# EAGLE design RN-131G Breakout-v13 (EAGLE 6.2)
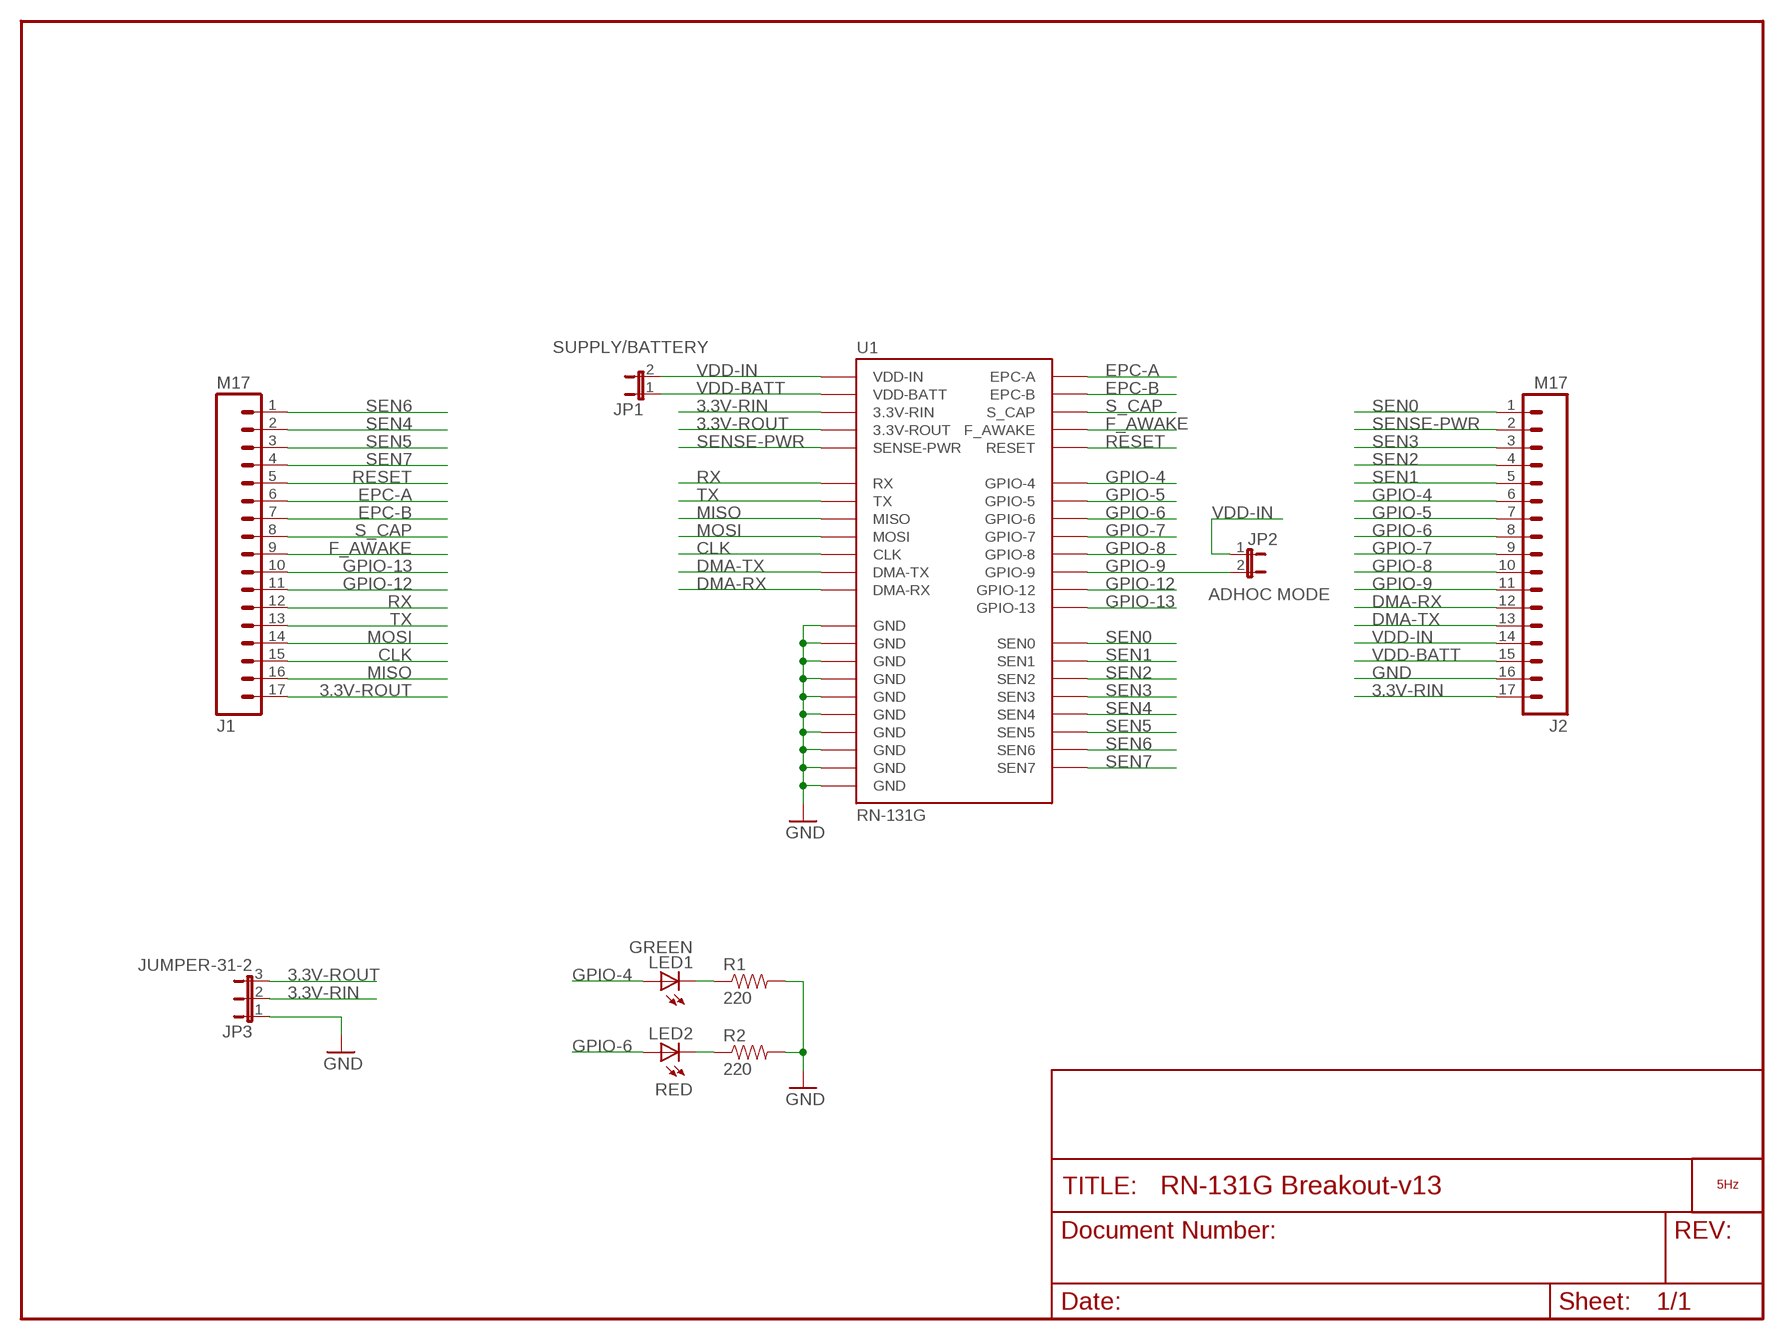
[diagram p0: schematic, sheet 1]

## Parts
J1  M17  [1X17]
J2  M17  [1X17]
JP1  JUMPER-2SMD-NO  [SJ_2S-NO]
JP2  JUMPER-2SMD-NO  [SJ_2S-NO]
JP3  JUMPER-31-2  [SJ_3_PASTE1&2]
LED1  GREEN  LED0603  [LED-0603]
LED2  RED  LED0603  [LED-0603]
LOGO1  LOGO_5HZ_H_10MM  [5HZ_LOGO_H_10MM]
R1  220  RESISTOR0402-RES  [0402-RES]
R2  220  RESISTOR0402-RES  [0402-RES]
U1  RN-131G  [RN-131G]

## Nets
3.3V-RIN: J2.17 JP3.2 U1.P$18(3.3V-RIN)
3.3V-ROUT: J1.17 JP3.3 U1.P$17(3.3V-ROUT)
CLK: J1.15 U1.P$15(CLK)
DMA-RX: J2.12 U1.P$23(DMA-RX)
DMA-TX: J2.13 U1.P$22(DMA-TX)
EPC-A: J1.6 U1.P$6(EPC-A)
EPC-B: J1.7 U1.P$7(EPC-B)
F_AWAKE: J1.9 U1.P$9(F_AWAKE)
GND: J2.16 JP3.1 R1.2 R2.2 U1.P$19(GND) U1.P$36(GND) U1.P$37(GND) U1.P$38(GND) U1.P$39(GND) U1.P$40(GND) U1.P$41(GND) U1.P$42(GND) U1.P$43(GND) U1.P$44(GND)
GPIO-4: J2.6 LED1.A U1.P$29(GPIO-4)
GPIO-5: J2.7 U1.P$28(GPIO-5)
GPIO-6: J2.8 LED2.A U1.P$27(GPIO-6)
GPIO-7: J2.9 U1.P$26(GPIO-7)
GPIO-8: J2.10 U1.P$25(GPIO-8)
GPIO-9: J2.11 JP2.2 U1.P$24(GPIO-9)
GPIO-12: J1.11 U1.P$11(GPIO-12)
GPIO-13: J1.10 U1.P$10(GPIO-13)
MISO: J1.16 U1.P$16(MISO)
MOSI: J1.14 U1.P$14(MOSI)
N$1: LED2.C R2.1
N$2: LED1.C R1.1
RESET: J1.5 U1.P$5(RESET)
RX: J1.12 U1.P$12(RX)
S_CAP: J1.8 U1.P$8(S_CAP)
SEN0: J2.1 U1.P$34(SEN0)
SEN1: J2.5 U1.P$30(SEN1)
SEN2: J2.4 U1.P$31(SEN2)
SEN3: J2.3 U1.P$32(SEN3)
SEN4: J1.2 U1.P$2(SEN4)
SEN5: J1.3 U1.P$3(SEN5)
SEN6: J1.1 U1.P$1(SEN6)
SEN7: J1.4 U1.P$4(SEN7)
SENSE-PWR: J2.2 U1.P$33(SENSE-PWR)
TX: J1.13 U1.P$13(TX)
VDD-BATT: J2.15 JP1.1 U1.P$20(VDD-BATT)
VDD-IN: J2.14 JP1.2 JP2.1 U1.P$21(VDD-IN)

## Notes on the sheet
- SUPPLY/BATTERY
- ADHOC MODE

## Library data of the parts
J1 J2 = SparkFun:M17
JP1 JP2 = SparkFun:JUMPER-2: Jumper Basic 0.1" spaced jumper. Use with breakaway headers.
JP3 = SparkFun:JUMPER-3
LED1 LED2 = SparkFun:LED: LEDs Standard schematic elements and footprints for 5mm, 3mm, 1206, and 0603 sized LEDs. 5mm - Spark Fun Electronics SKU : COM-00529 (and others)
LOGO1 = 5hz-electronica:LOGO_5HZ: Logotipo 5Hz "según Pedro"
R1 R2 = SparkFun:RESISTOR: Resistor Basic schematic elements and footprints for 0603, 1206, and PTH 1/10th watt (small) resistors.
U1 = SparkFun:RN-131G: Roving Netowrks WiFLy GSX Module

## Board
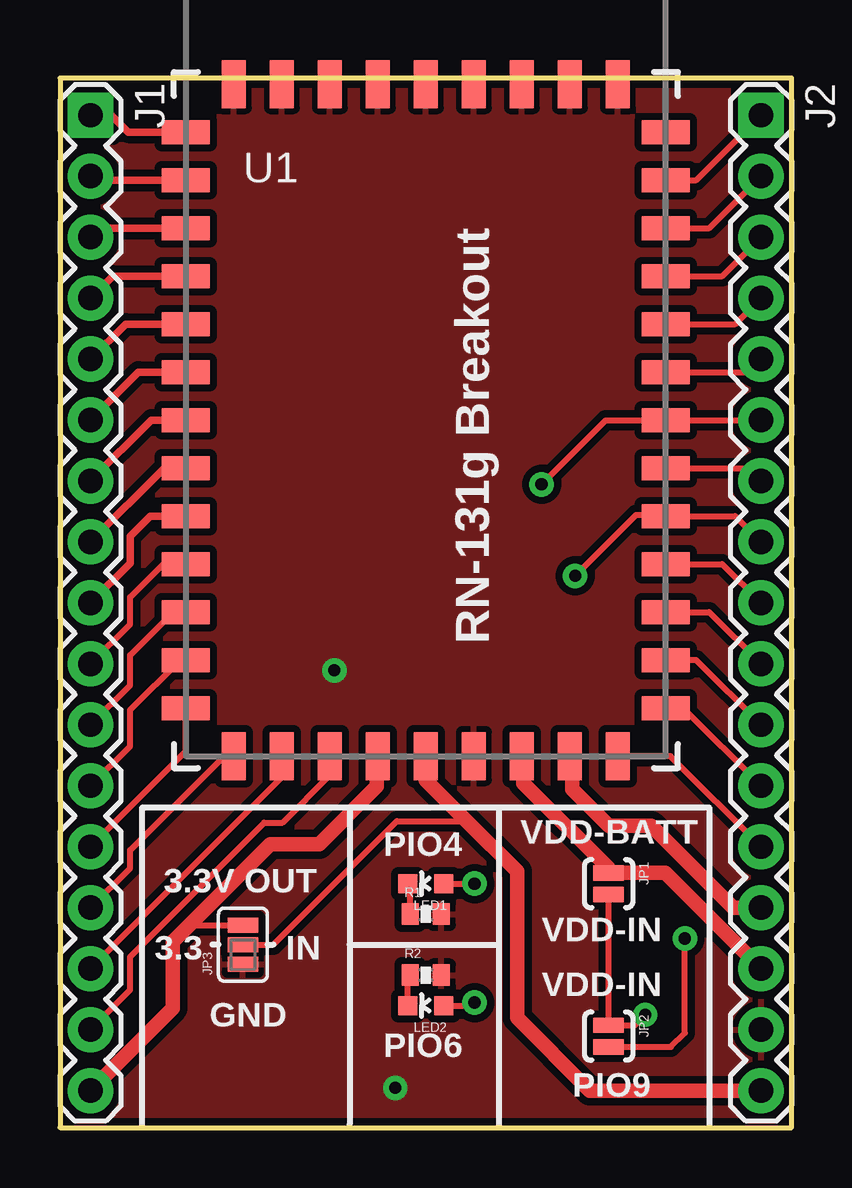
[diagram p1: board, top side]
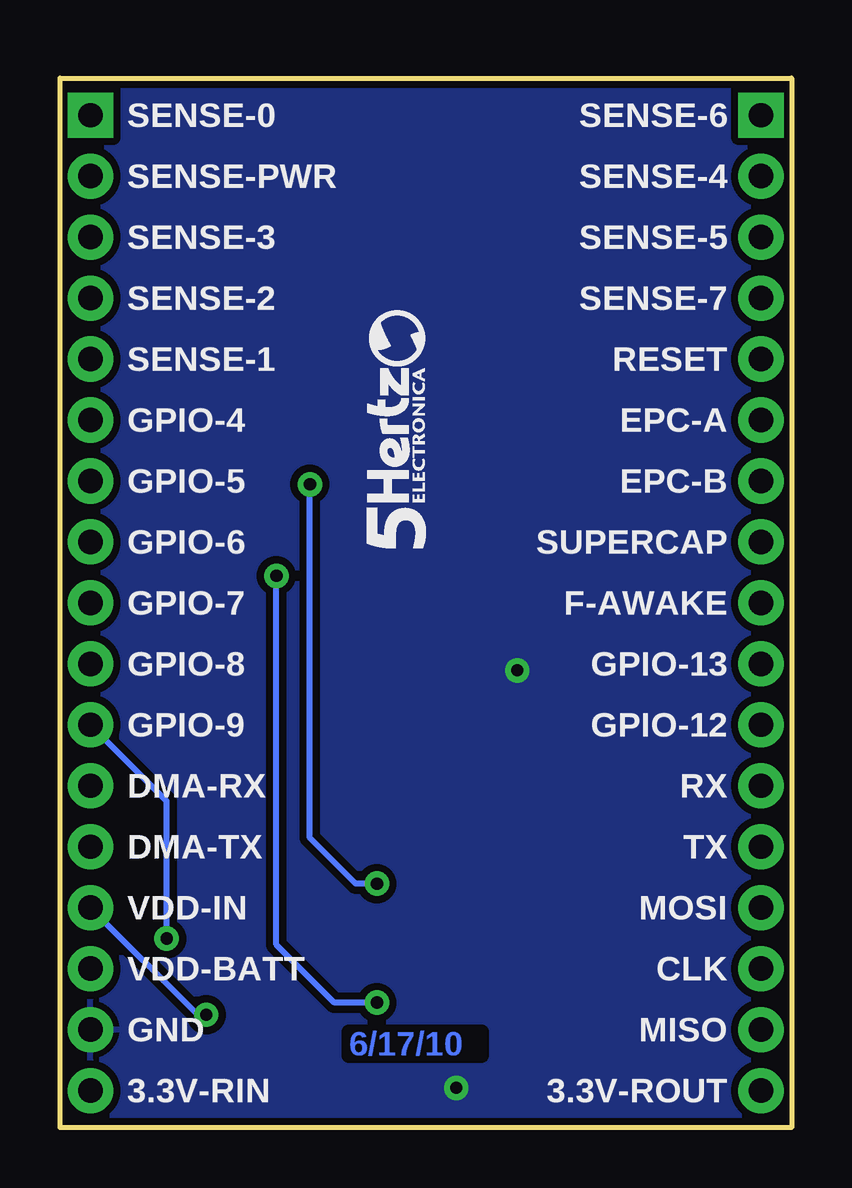
[diagram p2: board, bottom side, seen from below]

Size 30.48 x 43.72 mm. Coordinates in mm from the lower left corner, seen from the top.
Outline: 0,0 30.48,0 30.48,43.72 0,43.72 0,0
Copper layers (1*16): Top 0.0356mm / dielectric 1.5011mm / Bottom 0.0356mm
Design rules: minimum track width 8mil, minimum drill 20mil, track to track 8mil, track to pad 8mil, pad to pad 8mil, via to via 8mil, smd to smd 8mil, copper to edge 8mil, drill to drill 8mil, minimum pad ring 12mil, minimum via ring 10mil, stop-mask expansion 4mil, vias tented up to drill 20mil, thermal gap 10mil

### Footprints (pad centres in the part's own frame; a part is rotated, then mirrored left to right if it is on the bottom)
1X17 = drill 1.016 pad 1.88 square: 1 0,0 | drill 1.016 pad 1.88: 2 2.54,0; 3 5.08,0; 4 7.62,0; 5 10.16,0; 6 12.7,0; 7 15.24,0; 8 17.78,0; 9 20.32,0; 10 22.86,0; 11 25.4,0; 12 27.94,0; 13 30.48,0; 14 33.02,0; 15 35.56,0; 16 38.1,0; 17 40.64,0
SJ_2S-NO = smd 0.635 x 1.27: 1 -0.45,0; 2 0.45,0
SJ_3_PASTE1&2 = smd 0.635 x 1.27: 1 -0.813,0; 2 0,0; 3 0.813,0
LED-0603 = smd 0.8 x 0.8: A 0,-0.75; C 0,0.75
0402-RES = smd 0.7 x 0.9: 1 -0.65,0; 2 0.65,0
RN-131G = smd 2 x 1: P$1 -10,11; P$2 -10,9; P$3 -10,7; P$4 -10,5; P$5 -10,3; P$6 -10,1; P$7 -10,-1; P$8 -10,-3; P$9 -10,-5; P$10 -10,-7; P$11 -10,-9; P$12 -10,-11; P$13 -10,-13; P$23 10,-13; P$24 10,-11; P$25 10,-9; P$26 10,-7; P$27 10,-5; P$28 10,-3; P$29 10,-1; P$30 10,1; P$31 10,3; P$32 10,5; P$33 10,7; P$34 10,9; P$35 10,11 | smd 1 x 2: P$14 -8,-15; P$15 -6,-15; P$16 -4,-15; P$17 -2,-15; P$18 0,-15; P$19 2,-15; P$20 4,-15; P$21 6,-15; P$22 8,-15; P$36 8,13; P$37 6,13; P$38 4,13; P$39 2,13; P$40 0,13; P$41 -2,13; P$42 -4,13; P$43 -6,13; P$44 -8,13

### Placement (x,y rotation side)
J1  1.27,42.18 270 top
J2  29.21,42.18 270 top
JP1  22.86,10.16 270 top
JP2  22.86,3.81 270 top
JP3  7.62,7.62 90 top
LED1  15.24,10.16 90 top
LED2  15.24,5.08 90 top
LOGO1  15.24,24.13 90 bottom
R1  15.24,8.89 0 top
R2  15.24,6.35 0 top
U1  15.24,30.48 0 top

### Tracks (layer width: path | path; a pad name or v marks a point on that pad's centre or on a via)
3.3V-RIN
  Top 0.254: 15.24,14.48 U1.P$18 | 16.95,12.76 14.03,12.76 8.89,7.62 JP3.2
  Top 0.61: J2.17 22.08,1.54 19.05,4.57 19.05,10.67 16.95,12.76 15.24,14.48 15.24,15.49
3.3V-ROUT
  Top 0.254: JP3.3 5.38,8.43 5.33,8.38
  Top 0.61: J1.17 4.7,4.97 4.7,7.75 5.33,8.38 8.76,11.81 10.79,11.81 13.21,14.22 13.21,15.45 U1.P$17
CLK
  Top 0.254: U1.P$15 9.24,14.59 J1.15
DMA-RX
  Top 0.254: U1.P$23 25.97,17.48 J2.12
DMA-TX
  Top 0.254: U1.P$22 25.43,15.48 J2.13
EPC-A
  Top 0.305: U1.P$6 3.27,31.48 J1.6
EPC-B
  Top 0.305: U1.P$7 3.81,29.48 J1.7
F_AWAKE
  Top 0.305: U1.P$9 3.76,25.48 2.92,24.64 2.92,23.51 J1.9
GND  (via drill 0.51)
  other vias: 13.97,1.65 11.43,19.05
  pour Top (isolate 0.305): 0,0 30.48,0 30.48,43.72 0,43.72
  pour Bottom (isolate 0.305): 0,0 30.48,0 30.48,43.72 0,43.72
GPIO-4  (via drill 0.51)
  Top 0.254: J2.6 U1.P$29 25.22,29.46 22.73,29.46 v20.07,26.8 | LED1.A v17.27,10.16
  Bottom 0.254: v17.27,10.16 18.16,10.16 20.07,12.06 v20.07,26.8
GPIO-5
  Top 0.254: U1.P$28 28.67,27.48 J2.7
GPIO-6  (via drill 0.51)
  Top 0.254: J2.8 28.13,25.48 U1.P$27 25.19,25.53 24,25.53 v21.46,22.99 | LED2.A 17.14,5.08 v17.27,5.21
  Bottom 0.254: v17.27,5.21 19.05,5.21 21.46,7.62 v21.46,22.99
GPIO-7
  Top 0.254: U1.P$26 27.59,23.48 J2.9
GPIO-8
  Top 0.254: U1.P$25 27.05,21.48 J2.10
GPIO-9  (via drill 0.51)
  Top 0.254: U1.P$24 26.51,19.48 J2.11 | JP2.2 25.46,3.36 26.04,3.94 v26.04,7.87
  Bottom 0.254: v26.04,7.87 26.04,13.61 J2.11
GPIO-12
  Top 0.254: U1.P$11 4.72,21.48 2.92,19.68 2.92,18.43 J1.11
GPIO-13
  Top 0.254: U1.P$10 4.3,23.48 2.92,22.1 2.92,20.97 J1.10
MISO
  Top 0.254: U1.P$16 11.24,14.67 9.27,12.7 8.51,12.7 2.92,7.11 2.92,5.73 J1.16
MOSI
  Top 0.254: U1.P$14 6.84,15.48 2.92,11.56 2.92,10.81 J1.14
N$1
  Top 0.254: LED2.C 14.49,6.25 R2.1
N$2
  Top 0.254: R1.1 14.59,10.06 LED1.C
RESET
  Top 0.305: U1.P$5 2.73,33.48 J1.5
RX
  Top 0.254: U1.P$12 5,19.48 2.92,17.4 2.92,15.89 J1.12
S_CAP
  Top 0.305: U1.P$8 4.35,27.48 J1.8
SEN0
  Top 0.254: U1.P$34 26.51,39.48 J2.1
SEN1
  Top 0.254: U1.P$30 28.67,31.48 J2.5
SEN2
  Top 0.254: U1.P$31 28.13,33.48 J2.4
SEN3
  Top 0.254: U1.P$32 27.59,35.48 J2.3
SEN4
  Top 0.305: U1.P$2 1.43,39.48 J1.2
SEN5
  Top 0.305: U1.P$3 1.65,37.48 J1.3
SEN6
  Top 0.305: U1.P$1 2.84,41.48 2.16,42.16 1.29,42.16 J1.1
SEN7
  Top 0.305: U1.P$4 2.19,35.48 J1.4
SENSE-PWR
  Top 0.254: U1.P$33 27.05,37.48 J2.2
TX
  Top 0.254: U1.P$13 5.24,15.67 J1.13
VDD-BATT
  Top 0.61: J2.15 25.22,10.61 JP1.1 22.86,10.79 19.3,14.35 19.3,15.42 U1.P$20
VDD-IN  (via drill 0.51)
  Top 0.254: v24.38,4.7 23.95,4.26 JP2.1 JP1.2
  Top 0.61: J2.14 28.05,9.16 24.64,12.57 22.86,12.57 21.34,14.1 21.34,15.38 U1.P$21
  Bottom 0.254: v24.38,4.7 24.75,4.7 J2.14

### Text on the board
Bottom: 6/17/10
tPlace: RN-131g Breakout | VDD-BATT | PIO4 | 3.3V OUT | VDD-IN | 3.3 | IN | VDD-IN | GND | PIO6 | PIO9
bPlace: SENSE-6 | SENSE-0 | SENSE-4 | SENSE-PWR | SENSE-5 | SENSE-3 | SENSE-7 | SENSE-2 | RESET | SENSE-1 | EPC-A | GPIO-4 | EPC-B | GPIO-5 | SUPERCAP | GPIO-6 | F-AWAKE | GPIO-7 | GPIO-13 | GPIO-8 | GPIO-12 | GPIO-9 | RX | DMA-RX | TX | DMA-TX | MOSI | VDD-IN | CLK | VDD-BATT | MISO | GND | 3.3V-ROUT | 3.3V-RIN